# EAGLE schematic NuEVI (EAGLE 7.6.0)
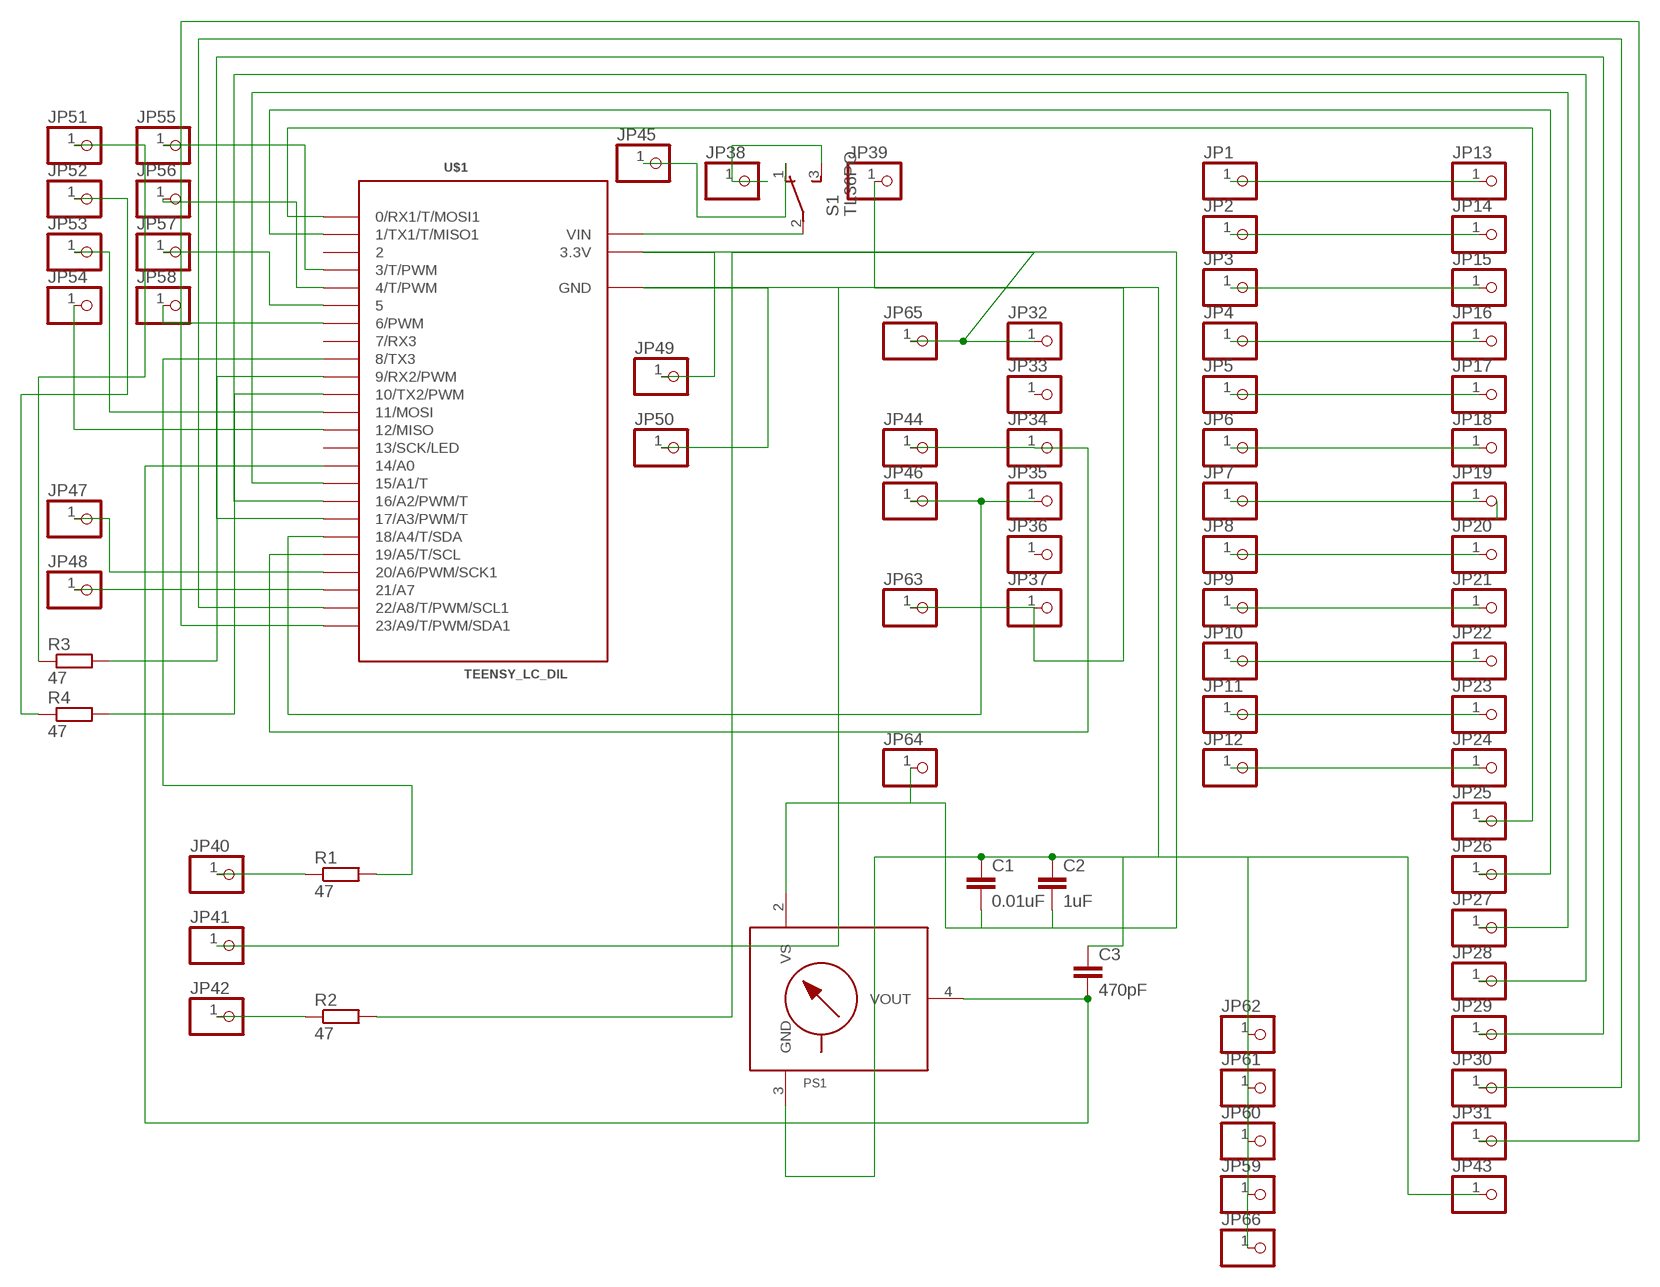
[diagram p0: schematic, sheet 1]

## Parts
C1  0.01uF  C-EU050-024X044  [C050-024X044]
C2  1uF  C-EU050-024X044  [C050-024X044]
C3  470pF  C-EU050-024X044  [C050-024X044]
JP1  PINHD-1X1  [1X01]
JP2  PINHD-1X1  [1X01]
JP3  PINHD-1X1  [1X01]
JP4  PINHD-1X1  [1X01]
JP5  PINHD-1X1  [1X01]
JP6  PINHD-1X1  [1X01]
JP7  PINHD-1X1  [1X01]
JP8  PINHD-1X1  [1X01]
JP9  PINHD-1X1  [1X01]
JP10  PINHD-1X1  [1X01]
JP11  PINHD-1X1  [1X01]
JP12  PINHD-1X1  [1X01]
JP13  PINHD-1X1  [1X01]
JP14  PINHD-1X1  [1X01]
JP15  PINHD-1X1  [1X01]
JP16  PINHD-1X1  [1X01]
JP17  PINHD-1X1  [1X01]
JP18  PINHD-1X1  [1X01]
JP19  PINHD-1X1  [1X01]
JP20  PINHD-1X1  [1X01]
JP21  PINHD-1X1  [1X01]
JP22  PINHD-1X1  [1X01]
JP23  PINHD-1X1  [1X01]
JP24  PINHD-1X1  [1X01]
JP25  PINHD-1X1  [1X01]
JP26  PINHD-1X1  [1X01]
JP27  PINHD-1X1  [1X01]
JP28  PINHD-1X1  [1X01]
JP29  PINHD-1X1  [1X01]
JP30  PINHD-1X1  [1X01]
JP31  PINHD-1X1  [1X01]
JP32  PINHD-1X1  [1X01]
JP33  PINHD-1X1  [1X01]
JP34  PINHD-1X1  [1X01]
JP35  PINHD-1X1  [1X01]
JP36  PINHD-1X1  [1X01]
JP37  PINHD-1X1  [1X01]
JP38  PINHD-1X1  [1X01]
JP39  PINHD-1X1  [1X01]
JP40  PINHD-1X1  [1X01]
JP41  PINHD-1X1  [1X01]
JP42  PINHD-1X1  [1X01]
JP43  PINHD-1X1  [1X01]
JP44  PINHD-1X1  [1X01]
JP45  PINHD-1X1  [1X01]
JP46  PINHD-1X1  [1X01]
JP47  PINHD-1X1  [1X01]
JP48  PINHD-1X1  [1X01]
JP49  PINHD-1X1  [1X01]
JP50  PINHD-1X1  [1X01]
JP51  PINHD-1X1  [1X01]
JP52  PINHD-1X1  [1X01]
JP53  PINHD-1X1  [1X01]
JP54  PINHD-1X1  [1X01]
JP55  PINHD-1X1  [1X01]
JP56  PINHD-1X1  [1X01]
JP57  PINHD-1X1  [1X01]
JP58  PINHD-1X1  [1X01]
JP59  PINHD-1X1  [1X01]
JP60  PINHD-1X1  [1X01]
JP61  PINHD-1X1  [1X01]
JP62  PINHD-1X1  [1X01]
JP63  PINHD-1X1  [1X01]
JP64  PINHD-1X1  [1X01]
JP65  PINHD-1X1  [1X01]
JP66  PINHD-1X1  [1X01]
PS1  MPX-1369  [1369]
R1  47  R-EU_0207/7  [0207/7]
R2  47  R-EU_0207/7  [0207/7]
R3  47  R-EU_0207/7  [0207/7]
R4  47  R-EU_0207/7  [0207/7]
S1  TL36PO  [TL3XPO]
U$1  TEENSY_LC_DIL  [TEENSY_3.0-3.2&LC_DIL]

## Nets
GND: C1.1 C2.1 C3.1 JP37.1 JP39.1 JP41.1 JP43.1 JP50.1 JP59.1 JP60.1 JP61.1 JP62.1 JP63.1 JP66.1 PS1.3(GND) U$1.AGND(GND) U$1.GND
N$1: JP1.1 JP13.1
N$2: JP2.1 JP14.1
N$3: JP3.1 JP15.1
N$4: JP4.1 JP16.1
N$5: JP5.1 JP17.1
N$6: JP6.1 JP18.1
N$8: JP7.1 JP19.1
N$9: JP8.1 JP20.1
N$10: JP9.1 JP21.1
N$11: JP10.1 JP22.1
N$12: JP11.1 JP23.1
N$13: JP25.1 U$1.0(0/RX1/T/MOSI1)
N$14: JP12.1 JP24.1
N$15: JP26.1 U$1.1(1/TX1/T/MISO1)
N$16: JP27.1 U$1.15/A1(15/A1/T)
N$17: JP28.1 U$1.16/A2(16/A2/PWM/T)
N$18: JP29.1 U$1.17/A3(17/A3/PWM/T)
N$19: JP30.1 U$1.22/A8(22/A8/T/PWM/SCL1)
N$20: JP31.1 U$1.23/A9(23/A9/T/PWM/SDA1)
N$21: C1.2 C2.2 JP32.1 JP49.1 JP64.1 JP65.1 PS1.2(VS) R2.2 U$1.3.3V
N$22: JP47.1 U$1.20/A6(20/A6/PWM/SCK1)
N$23: JP34.1 JP44.1 U$1.19/A5(19/A5/T/SCL)
N$24: JP35.1 JP46.1 U$1.18/A4(18/A4/T/SDA)
N$25: JP38.1 S1.3(S)
N$26: R1.2 U$1.8(8/TX3)
N$27: JP40.1 R1.1
N$28: JP42.1 R2.1
N$29: C3.2 PS1.4(VOUT) U$1.14/A0
N$30: S1.2(P) U$1.VIN
N$31: JP48.1 U$1.21/A7
N$32: JP51.1 R3.1
N$33: JP52.1 R4.1
N$34: JP53.1 U$1.11(11/MOSI)
N$35: JP54.1 U$1.12(12/MISO)
N$36: JP55.1 U$1.3(3/T/PWM)
N$37: JP56.1 U$1.4(4/T/PWM)
N$38: JP57.1 U$1.5
N$39: JP58.1 U$1.6(6/PWM)
N$40: JP45.1 S1.1(O)
N$41: R4.2 U$1.10(10/TX2/PWM)
N$43: R3.2 U$1.9(9/RX2/PWM)
Unconnected: JP33.1 JP36.1 PS1.1(NC) PS1.5(NC) PS1.6(NC) U$1.2 U$1.7(7/RX3) U$1.13(13/SCK/LED)

## Library data of the parts
C1-C3 = rcl:C-EU: CAPACITOR, European symbol
JP1-JP66 = pinhead:PINHD-1X1: PIN HEADER
PS1 = mpx-freescale:MPX*****: Generic MPX pressure sensor
R1-R4 = resistor:R-EU_: RESISTOR, European symbol
S1 = switch:TL36PO: TINY SWITCH ON - ON Source: http://www2.produktinfo.conrad.com/datenblaetter/700000-724999/705152-da-01-de-Subminiaturschalter_TL_36YO.pdf
U$1 = Teensy_3_and_LC_Series_Boards_v1.4:TEENSY_LC_DIL